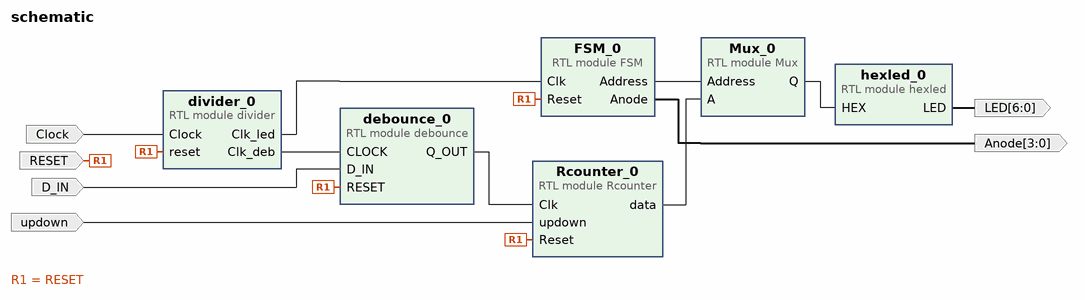
[diagram p0: block diagram of the top level]
# Vivado block design schematic, xc7a100tcsg324-1, Vivado 2020.2
create_bd_design schematic

create_bd_port -dir I updown
create_bd_port -dir I RESET
create_bd_port -dir I D_IN
create_bd_port -dir I Clock
create_bd_port -dir O -from 6 -to 0 LED
create_bd_port -dir O -from 3 -to 0 Anode

create_bd_cell -type module -reference debounce debounce_0
create_bd_cell -type module -reference hexled hexled_0
create_bd_cell -type module -reference Mux Mux_0
create_bd_cell -type module -reference Rcounter Rcounter_0
create_bd_cell -type module -reference FSM FSM_0
create_bd_cell -type module -reference divider divider_0

# ---- connections ----

connect_bd_net [get_bd_ports RESET] \
  [get_bd_pins debounce_0/RESET] [get_bd_pins FSM_0/Reset] [get_bd_pins Rcounter_0/Reset] [get_bd_pins divider_0/reset]
connect_bd_net [get_bd_ports D_IN] [get_bd_pins debounce_0/D_IN]
connect_bd_net [get_bd_ports Clock] [get_bd_pins divider_0/Clock]
connect_bd_net [get_bd_ports updown] [get_bd_pins Rcounter_0/updown]
connect_bd_net [get_bd_pins debounce_0/Q_OUT] [get_bd_pins Rcounter_0/Clk]
connect_bd_net [get_bd_pins divider_0/Clk_deb] [get_bd_pins debounce_0/CLOCK]
connect_bd_net [get_bd_pins divider_0/Clk_led] [get_bd_pins FSM_0/Clk]
connect_bd_net [get_bd_pins Rcounter_0/data] [get_bd_pins Mux_0/A]
connect_bd_net [get_bd_pins FSM_0/Address] [get_bd_pins Mux_0/Address]
connect_bd_net [get_bd_pins hexled_0/LED] [get_bd_ports LED]
connect_bd_net [get_bd_pins Mux_0/Q] [get_bd_pins hexled_0/HEX]
connect_bd_net [get_bd_pins FSM_0/Anode] [get_bd_ports Anode]

validate_bd_design
save_bd_design
